# Altium schematic sheet toplevel.SchDoc
size A4
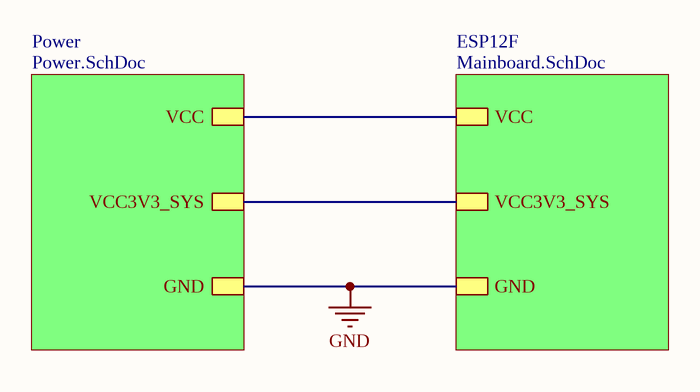
[diagram p0: toplevel.SchDoc]

## Sub-sheets
ESP12F = Mainboard.SchDoc: GND, VCC3V3_SYS, VCC
Power = Power.SchDoc: GND, VCC3V3_SYS, VCC

## Nets
GND: sheet ESP12F/GND, sheet Power/GND
(unnamed): sheet ESP12F/VCC3V3_SYS, sheet Power/VCC3V3_SYS
(unnamed): sheet ESP12F/VCC, sheet Power/VCC